# Altium project nRF-TestDevice.PrjPCB (part 2 of 2)

## Sheet FTDI.SchDoc
size A3; DocumentNumber: 5; SheetNumber: 5; SheetTotal: 9
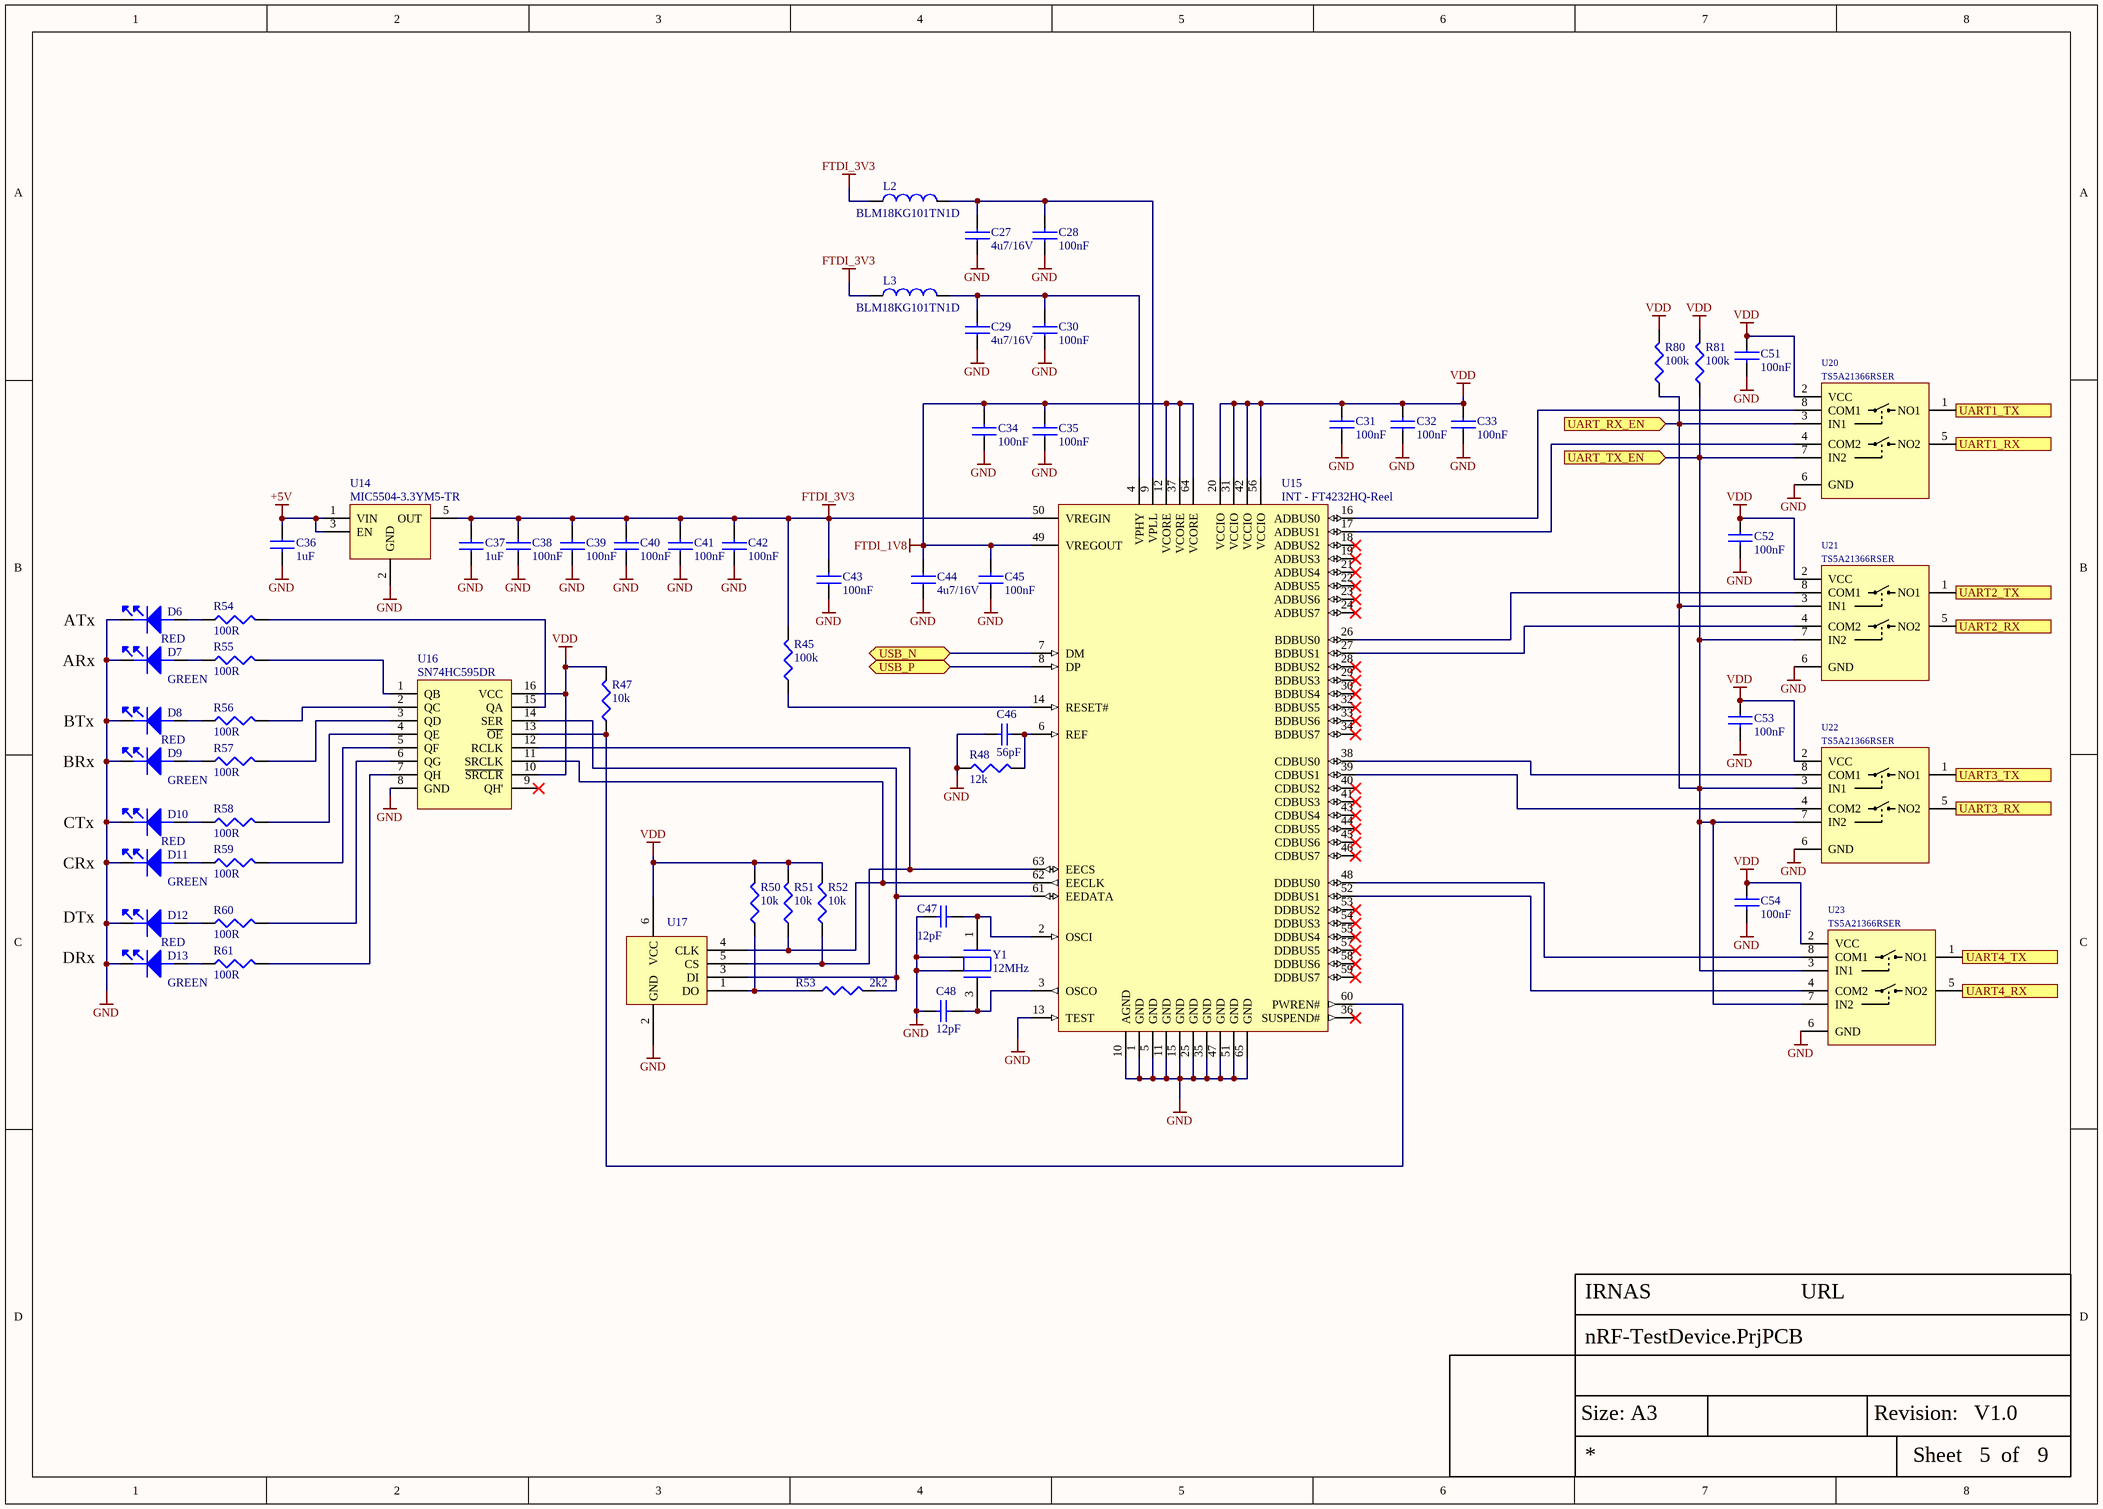
[diagram p6: FTDI.SchDoc]

### Parts
C27  4u7/16V  [CAP0603]
C28  100nF  [CAP0402]
C29  4u7/16V  [CAP0603]
C30  100nF  [CAP0402]
C31  100nF  [CAP0402]
C32  100nF  [CAP0402]
C33  100nF  [CAP0402]
C34  100nF  [CAP0402]
C35  100nF  [CAP0402]
C36  1uF  [CAP0402]
C37  1uF  [CAP0402]
C38  100nF  [CAP0402]
C39  100nF  [CAP0402]
C40  100nF  [CAP0402]
C41  100nF  [CAP0402]
C42  100nF  [CAP0402]
C43  100nF  [CAP0402]
C44  4u7/16V  [CAP0603]
C45  100nF  [CAP0402]
C46  value 56pF  [CAP0402]  (hidden comment: 56pF/50V/0402)
C47  value 12pF  [CAP0402]  (hidden comment: 12pF/50V/0402)
C48  value 12pF  [CAP0402]  (hidden comment: 12pF/50V/0402)
C51  100nF  [CAP0402]
C52  100nF  [CAP0402]
C53  100nF  [CAP0402]
C54  100nF  [CAP0402]
D6  LED RED  [LED0603]  (value not drawn)
D7  LED GREEN  [LED0603]  (value not drawn)
D8  LED RED  [LED0603]  (value not drawn)
D9  LED GREEN  [LED0603]  (value not drawn)
D10  LED RED  [LED0603]  (value not drawn)
D11  LED GREEN  [LED0603]  (value not drawn)
D12  LED RED  [LED0603]  (value not drawn)
D13  LED GREEN  [LED0603]  (value not drawn)
L2  BLM18KG101TN1D  [IND0603]
L3  BLM18KG101TN1D  [IND0603]
R45  100k  [RES0402]
R47  10k  [RES0402]
R48  12k  [RES0402]
R50  10k  [RES0402]
R51  10k  [RES0402]
R52  10k  [RES0402]
R53  2k2  [RES0402]
R54  100R  [RES0402]
R55  100R  [RES0402]
R56  100R  [RES0402]
R57  100R  [RES0402]
R58  100R  [RES0402]
R59  100R  [RES0402]
R60  100R  [RES0402]
R61  100R  [RES0402]
R80  100k  [RES0402]
R81  100k  [RES0402]
U14  MIC5504-3.3YM5-TR  [SOT23-5]
U15  INT - FT4232HQ-Reel  [QFN64_2_N]
U16  SN74HC595DR  [SOIC-16]
U17  93LC56BT-E/OT  [SOT95P270X145-6N]  (value not drawn)
U20  TS5A21366RSER  [UQFN-8]
U21  TS5A21366RSER  [UQFN-8]
U22  TS5A21366RSER  [UQFN-8]
U23  TS5A21366RSER  [UQFN-8]
Y1  12MHz  [CRY2.5X2]

### Ports
UART1_RX (in), UART1_TX (out), UART2_RX (in), UART2_TX (out), UART3_RX (in), UART3_TX (out), UART4_RX (in), UART4_TX (out), UART_RX_EN (in), UART_TX_EN (in), USB_N (bidir), USB_P (bidir)

### Nets
+5V: C36.1 U14.1(VIN) U14.3(EN)  [project net 5V]
FTDI_1V8: C34.2 C35.2 C44.2 C45.2 U15.12(VCORE) U15.37(VCORE) U15.49(VREGOUT) U15.64(VCORE)
FTDI_3V3: C37.2 C38.2 C39.2 C40.2 C41.2 C42.2 C43.2 L2.1 L3.1 R45.2 U14.5(OUT) U15.50(VREGIN)
GND: C27.1 C28.1 C29.1 C30.1 C31.1 C32.1 C33.1 C34.1 C35.1 C36.2 C37.1 C38.1 C39.1 C40.1 C41.1 C42.1 C43.1 C44.1 C45.1 C46.1 C47.1 C48.1 C51.2 C52.2 C53.2 C54.2 D6.1(cathode) D7.1(cathode) D8.1(cathode) D9.1(cathode) D10.1(cathode) D11.1(cathode) D12.1(cathode) D13.1(cathode) R48.1 U14.2(GND) U15.1(GND) U15.5(GND) U15.10(AGND) U15.11(GND) U15.13(TEST) U15.15(GND) U15.25(GND) U15.35(GND) U15.47(GND) U15.51(GND) U15.65(GND) U16.8(GND) U17.2(GND) U20.6(GND) U21.6(GND) U22.6(GND) U23.6(GND) Y1.2 Y1.4
VDD: C31.2 C32.2 C33.2 C51.1 C52.1 C53.1 C54.1 R47.2 R50.2 R51.2 R52.2 R80.2 R81.2 U15.20(VCCIO) U15.31(VCCIO) U15.42(VCCIO) U15.56(VCCIO) U16.10(~{SRCLR}) U16.16(VCC) U17.6(VCC) U20.2(VCC) U21.2(VCC) U22.2(VCC) U23.2(VCC)
P0.11: R80.1 R81.1 U20.3(IN1) U20.7(IN2) U21.3(IN1) U21.7(IN2) U22.3(IN1) U22.7(IN2) U23.3(IN1) U23.7(IN2) ; port UART_RX_EN, port UART_TX_EN
UART1_RX: U20.5(NO2) ; port UART1_RX
UART1_TX: U20.1(NO1) ; port UART1_TX
UART2_RX: U21.5(NO2) ; port UART2_RX
UART2_TX: U21.1(NO1) ; port UART2_TX
UART3_RX: U22.5(NO2) ; port UART3_RX
UART3_TX: U22.1(NO1) ; port UART3_TX
UART4_RX: U23.5(NO2) ; port UART4_RX
UART4_TX: U23.1(NO1) ; port UART4_TX
USB_N: U15.7(DM) ; port USB_N
USB_P: U15.8(DP) ; port USB_P
NetC27_2: C27.2 C28.2 L2.2 U15.9(VPLL)
NetC29_2: C29.2 C30.2 L3.2 U15.4(VPHY)
NetC46_2: C46.2 R48.2 U15.6(REF)
NetC47_2: C47.2 U15.2(OSCI) Y1.1
NetC48_2: C48.2 U15.3(OSCO) Y1.3
NetD6_2: D6.2(ANODE) R54.1
NetD7_2: D7.2(ANODE) R55.1
NetD8_2: D8.2(ANODE) R56.1
NetD9_2: D9.2(ANODE) R57.1
NetD10_2: D10.2(ANODE) R58.1
NetD11_2: D11.2(ANODE) R59.1
NetD12_2: D12.2(ANODE) R60.1
NetD13_2: D13.2(ANODE) R61.1
NetR45_1: R45.1 U15.14(RESET#)
NetR47_1: R47.1 U15.60(PWREN#) U16.13(~{OE})
NetR50_1: R50.1 R53.1 U17.1(DO)
NetR51_1: R51.1 U15.62(EECLK) U16.11(SRCLK) U17.4(CLK)
NetR52_1: R52.1 U15.63(EECS) U16.12(RCLK) U17.5(CS)
NetR53_2: R53.2 U15.61(EEDATA) U16.14(SER) U17.3(DI)
NetR54_2: R54.2 U16.15(QA)
NetR55_2: R55.2 U16.1(QB)
NetR56_2: R56.2 U16.2(QC)
NetR57_2: R57.2 U16.3(QD)
NetR58_2: R58.2 U16.4(QE)
NetR59_2: R59.2 U16.5(QF)
NetR60_2: R60.2 U16.6(QG)
NetR61_2: R61.2 U16.7(QH)
NetU15_16: U15.16(ADBUS0) U20.8(COM1)
NetU15_17: U15.17(ADBUS1) U20.4(COM2)
NetU15_26: U15.26(BDBUS0) U21.8(COM1)
NetU15_27: U15.27(BDBUS1) U21.4(COM2)
NetU15_38: U15.38(CDBUS0) U22.8(COM1)
NetU15_39: U15.39(CDBUS1) U22.4(COM2)
NetU15_48: U15.48(DDBUS0) U23.8(COM1)
NetU15_52: U15.52(DDBUS1) U23.4(COM2)

Not connected (* = marked no-connect by the designer): U15 18(ADBUS2)* 19(ADBUS3)* 21(ADBUS4)* 22(ADBUS5)* 23(ADBUS6)* 24(ADBUS7)* 28(BDBUS2)* 29(BDBUS3)* 30(BDBUS4)* 32(BDBUS5)* 33(BDBUS6)* 34(BDBUS7)* 36(SUSPEND#)* 40(CDBUS2)* 41(CDBUS3)* 43(CDBUS4)* 44(CDBUS5)* 45(CDBUS6)* 46(CDBUS7)* 53(DDBUS2)* 54(DDBUS3)* 55(DDBUS4)* 57(DDBUS5)* 58(DDBUS6)* 59(DDBUS7)*; U16 9(QH')*

### Notes on the sheet
- ATx
- ARx
- BTx
- BRx
- CTx
- CRx
- DTx
- DRx
- Size: A3
- Revision:
- Sheet
- of
- (in symbol LED - LED GREEN) GREEN
- (in symbol LED - LED RED) RED

### Library data of the parts
C27 C29 C44 = C - 4u7  16V 0603: MURATA - GRM188R61C475KAAJD - CAP, MLCC, X5R, 4.7UF, 16V, 0603; IRNAS Part No.: I-200001; Ceramic Capacitor Case: 0603 [1608 Metric]; Capacitance: 4.7; Voltage Rating: 16; Capacitance Tolerance: ± 10%; Dielectric Characteristic: X5; Product Range: GRM Series; SVHC: No SVHC (17-Dec-2015)<!--FANDB--><div class="features-and-benefits-container"><div class="features-and-benefits-desc-container"><span class="features-and-benefits-container-desc">SMD Multilayer Ceramic Capacitor, 0603 [1608 Metric], 4.7 µF, 16 V, ± 10%, X5; Supplier 1: Farnell; Manufacturer: MURATA; Manufacturer Part Number: GRM188R61C475KAAJD; RoHS: YES; Stock 1: 5038; Pricing 1: 10=0.16, 100=0.0929, 500=0.076, 1000=0.0618, 2000=0.0605, 4000=0.0425, 20000=0.0409, 40000=0.0355 (GBP); Packaging: Cut Tape; Operating Temperature Min: -55; Operating Temperature Max: 85; Automotive Qualification Standard: -; MSL: MSL 1 - Unlimited; ComponentLink1URL: http://www.farnell.com/datasheets/2079168.pdf; ComponentLink1Description: http://www.farnell.com/datasheets/2079168.pdf; Supplier Part Number 1: 2611924
C28 C30-C35 C38-C43 C45 C51-C54 = C - 100nF/0402: as C18 on sheet ADC; Supplier 1: Farnell; Manufacturer: Multicomp; Manufacturer Part Number: MC0402X104J160CT; Stock 1: 3230; Pricing 1: 10=0.0139, 100=0.0108, 500=0.0076, 2500=0.0051, 5000=0.0038 (EUR); Case Code (Metric): 1005; Case Code (Imperial): 0402; Min Operating Temperature: -55°C; Max Operating Temperature: 85°C; Capacitance: 100nF; Dielectric: X5R; Packaging: Tape and Reel; Tolerance: 5%; Voltage Rating (DC): 16V; REACH SVHC: No SVHC; ComponentLink1URL: http://www.farnell.com/datasheets/2117933.pdf; ComponentLink1Description: http://www.farnell.com/datasheets/2117933.pdf; ComponentLink2URL: http://www.farnell.com/datasheets/2117900.pdf; ComponentLink2Description: http://www.farnell.com/datasheets/2117900.pdf; Supplier Part Number 1: 2627419
C36 C37 = C - 1uF/0402: CAP CER 1UF 10V 20% X5R 0402; Manufacturer: Murata; Manufacturer Part Number: GRM155R61A105ME15D; IRNAS Part No.: /; Supplier 1: Farnell; Stock 1: 0; Pricing 1: 10=0.0379, 100=0.0266, 500=0.0156, 2500=0.0098, 5000=0.0083 (EUR); Mount: Surface Mount; Case/Package: 0402; Case Code (Metric): 1005; Case Code (Imperial): 0402; Min Operating Temperature: -55°C; Max Operating Temperature: 85°C; Capacitance: 1uF; Tolerance: 20%; Voltage Rating: 10V; Packaging: Tape and Reel; Package Quantity: 1; Dielectric: X5R; Voltage: 10V; Voltage Rating (DC): 10V; Length: 1mm; Height: 0.5mm; Width: 0.02inch; Thickness: 0.022inch; Depth: 0.5mm; Radiation Hardening: No; REACH SVHC: No SVHC; Lead Free: Lead Free; ComponentLink1URL: https://datasheet.ciiva.com/164/product-164665.pdf; ComponentLink1Description: https://datasheet.ciiva.com/164/product-164665.pdf; ComponentLink2URL: https://datasheet.ciiva.com/11616/product-11616508.pdf; ComponentLink2Description: https://datasheet.ciiva.com/11616/product-11616508.pdf; ComponentLink3URL: https://datasheet.ciiva.com/46418/1769893-46418047.pdf; ComponentLink3Description: https://datasheet.ciiva.com/46418/1769893-46418047.pdf; ComponentLink4URL: https://datasheet.ciiva.com/164/partnumbering-e-01-164666.pdf; ComponentLink4Description: https://datasheet.ciiva.com/164/partnumbering-e-01-164666.pdf; ComponentLink5URL: https://datasheet.ciiva.com/164/partnumbering-e-01-164667.pdf; ComponentLink5Description: https://datasheet.ciiva.com/164/partnumbering-e-01-164667.pdf; Supplier Part Number 1: 2426953
C46 = C - 56pF/50V/0402: CAP CER 56PF 50V C0G/NP0 0402; Published: 8-Jun-2000; LatestRevisionDate: 05-oct-2007  -  Semtech; LatestRevisionNote: Re-released for DXP Platform.; Publisher: Altium Limited; Supplier 1: Digi-Key; Supplier Part Number 1: 490-1288-1-ND
C47 C48 = C - 12pF/50V/0402: CAP CER 12PF 50V C0G/NP0 0402; Published: 8-Jun-2000; LatestRevisionDate: 05-oct-2007  -  Semtech; LatestRevisionNote: Re-released for DXP Platform.; Publisher: Altium Limited; Supplier 1: Digi-Key; Supplier Part Number 1: 490-5924-1-ND
D6 D8 D10 D12 = LED - LED RED: BROADCOM LIMITED - HSMS-C190 - LED, RED, 10MCD, 626NM; LED Mounting: SMD; Forward Current If: 20; Forward Voltage: 2.1; Wavelength Typ: 626; Luminous Intensity: 10; Viewing Angle: 170°; Lens Shape: Rectangular; SVHC: No SVHC (17-Dec-2015)<!--FANDB--><div class="features-and-benefits-container"><div class="features-and-benefits-description"><span class="features-benefits-value">The HSMS-C190 is a HER SMD Chip LED with untinted/diffused lens, made of GaP. It is designed in an industry standard package 1.6 x 0.8mm footprint with 0.8mm profile. It is compatible with IR reflow solder processes. The small size and wide viewing angle make this LED prime choices for backlighting applications and front panel illumination especially where space is a premium.</span></div><div class="features-and-benefits-list"><ul class="features-and-benefits-list-list"><li class="features-and-benefits-list-item">Small size</li><li class="features-and-benefits-list-item">Industry standard footprint</li><li class="features-and-benefits-list-item">Compatible with IR solder</li><li class="features-and-benefits-list-item">Diffused optics</li><li class="features-and-benefits-list-item">-40 to 85; Supplier 1: Farnell; Manufacturer: BROADCOM LIMITED; Manufacturer Part Number: HSMS-C190; RoHS: YES; Stock 1: 7534; Pricing 1: 1=0.361, 10=0.256, 50=0.235, 100=0.106, 200=0.101 (GBP); LED Colour: Red; Bulb Size: -; Packaging: Cut Tape; Product Range: -; Automotive Qualification Standard: -; MSL: -; ComponentLink1URL: http://www.farnell.com/datasheets/313031.pdf; ComponentLink1Description: http://www.farnell.com/datasheets/313031.pdf; ComponentLink2URL: http://www.farnell.com/datasheets/1681524.pdf; ComponentLink2Description: http://www.farnell.com/datasheets/1681524.pdf; ComponentLink3URL: http://www.farnell.com/datasheets/2165483.pdf; ComponentLink3Description: http://www.farnell.com/datasheets/2165483.pdf; Supplier Part Number 1: 2497356
D7 D9 D11 D13 = LED - LED GREEN: HSME-C191 -  LED, Green, SMD, 0603, 20 mA, 2.1 V, 572 nm; Manufacturer: BROADCOM LIMITED; Manufacturer Part Number: HSMS-C190; LED Colour: Red; Forward Current If: 20; Forward Voltage: 2.1; Wavelength Typ: 626; Luminous Intensity: 10; Viewing Angle: 170°; Lens Shape: Rectangular; SVHC: No SVHC (17-Dec-2015)<!--FANDB--><div class="features-and-benefits-container"><div class="features-and-benefits-description"><span class="features-benefits-value">The HSMS-C190 is a HER SMD Chip LED with untinted/diffused lens, made of GaP. It is designed in an industry standard package 1.6 x 0.8mm footprint with 0.8mm profile. It is compatible with IR reflow solder processes. The small size and wide viewing angle make this LED prime choices for backlighting applications and front panel illumination especially where space is a premium.</span></div><div class="features-and-benefits-list"><ul class="features-and-benefits-list-list"><li class="features-and-benefits-list-item">Small size</li><li class="features-and-benefits-list-item">Industry standard footprint</li><li class="features-and-benefits-list-item">Compatible with IR solder</li><li class="features-and-benefits-list-item">Diffused optics</li><li class="features-and-benefits-list-item">-40 to 85; RoHS: YES; Stock 1: 7534; Pricing 1: 1=0.361, 10=0.256, 50=0.235, 100=0.106, 200=0.101 (GBP); LED Mounting: SMD; Bulb Size: -; Packaging: Cut Tape; Product Range: -; Automotive Qualification Standard: -; MSL: -; ComponentLink3URL: http://www.farnell.com/datasheets/2095939.pdf?_ga=2.85835929.1644194861.1561957338-1373726713.1554121096; ComponentLink3Description: Datasheet; Supplier 1: Farnell; Supplier Part Number 1: 1219743
L2 L3 = L - BLM18KG101TN1D: Ferrite Bead, 0603 [1608 Metric], 100 ohm, 3 A, BLM18K Series, 0.03 ohm, ± 25%; ComponentLink1Description: Datasheet; ComponentLink1URL: https://www.murata.com/en-global/api/pdfdownloadapi?cate=luNoiseSupprFilteChipFerriBead&partno=BLM18KG101TN1%23; Supplier 1: Farnell; Supplier Part Number 1: 2443239
R45 R80 R81 = R - 100k/0402: MULTICOMP   MCWR04X1003FTL   RES, THICK FILM, 100KOHM, 1%, 0.0625W; IRNAS Part No.: I-100013; Resistance: 100kR; Power Rating: 62.5mW; Voltage Rating: 50V; Temperature Coefficient: 100ppm/°C; Supplier 1: Farnell; Manufacturer: Multicomp; Manufacturer Part Number: MCWR04X1003FTL; Stock 1: 161188; Pricing 1: 10=0.0029, 100=0.0017, 500=0.0012, 2500=0.001, 5000=0.0008 (EUR); Mount: Surface Mount; Case/Package: 0402; Case Code (Metric): 1005; Case Code (Imperial): 0402; Tolerance: 1%; Packaging: Cut Tape; Composition: Thick Film; Voltage Rating (DC): 50V; REACH SVHC: No SVHC; ComponentLink1URL: https://datasheet.ciiva.com/46386/1849611-46386524.pdf; ComponentLink1Description: https://datasheet.ciiva.com/46386/1849611-46386524.pdf; Supplier Part Number 1: 2447094
R47 R50-R52 = R - 10k/0402: MULTICOMP         MCWR04X1002FTL             SMD Chip Resistor, Thick Film, 10 kohm, 50 V, 0402 [1005 Metric], 62.5 mW,  1%, MCWR Series; IRNAS Part No.: I-100014; Resistance: 10kR; Voltage Rating: 50V; Power Rating: 62.5mW; Temperature Coefficient: 100ppm/°C; Supplier 1: Farnell; Manufacturer: Multicomp; Manufacturer Part Number: MCWR04X1002FTL; Stock 1: 602609; Pricing 1: 10=0.0029, 100=0.0017, 500=0.0012, 2500=0.001, 5000=0.0008 (EUR); Case/Package: 0402; Case Code (Metric): 1005; Case Code (Imperial): 0402; Packaging: Cut Tape; Composition: Thick Film; Tolerance: 1%; Voltage Rating (DC): 50V; REACH SVHC: No SVHC; ComponentLink1URL: http://www.farnell.com/datasheets/1849611.pdf; ComponentLink1Description: http://www.farnell.com/datasheets/1849611.pdf; Supplier Part Number 1: 2447096
R48 = R - 12k/0402: MULTICOMP         MCWR04X1202FTL             SMD Chip Resistor, Thick Film, 12 kohm, 50 V, 0402 [1005 Metric], 62.5 mW,  1%, MCWR Series; IRNAS Part No.: /; Voltage Rating (DC): 50V; Resistance: 12kR; Power Rating: 62.5mW; Temperature Coefficient: 100ppm/°C; Supplier 1: Farnell; Manufacturer: Multicomp; Manufacturer Part Number: MCWR04X1202FTL; Stock 1: 11542; Pricing 1: 10=0.0033, 100=0.002, 500=0.0014, 2500=0.0011, 5000=0.0009 (EUR); Case/Package: 0402; Case Code (Metric): 1005; Case Code (Imperial): 0402; Packaging: Cut Tape; Tolerance: 1%; Voltage Rating: 50V; Composition: Thick Film; REACH SVHC: No SVHC; ComponentLink1URL: http://www.farnell.com/datasheets/1849611.pdf; ComponentLink1Description: http://www.farnell.com/datasheets/1849611.pdf; Supplier Part Number 1: 2447104
R53 = R - 2k2/0402: SMD Chip Resistor, 2.2 kohm, ± 1%, 62.5 mW, 0402 [1005 Metric], Thick Film, General Purpose /; ComponentLink1Description: Datasheet; ComponentLink1URL: http://www.farnell.com/datasheets/2860681.pdf?_ga=2.145444532.1645569087.1597147308-393619177.1578660480; Supplier 1: Farnell; Supplier Part Number 1: 2447148
R54-R61 = R - 100R/0402: MULTICOMP         MCMR04X1000FTL            SMD Chip Resistor, Ceramic, MCMR Series, 100 ohm, 50 V, 0402 [1005 Metric], 62.5 mW,  1%; IRNAS Part No.: /; Temperature Coefficient: 100ppm/°C; Power Rating: 62.5mW; Voltage Rating: 50V; Supplier 1: Farnell; Manufacturer: Multicomp; Manufacturer Part Number: MCMR04X1000FTL; Stock 1: 62365; Pricing 1: 10=0.0071, 100=0.0042, 500=0.003, 2500=0.0024, 5000=0.0019 (GBP); Case/Package: 0402; Case Code (Metric): 1005; Case Code (Imperial): 0402; Resistance: 100R; Tolerance: 1%; Composition: Ceramic; Packaging: Cut Tape; Voltage Rating (DC): 50V; REACH SVHC: No SVHC; ComponentLink1URL: https://datasheet.ciiva.com/28692/1716705-28692087.pdf; ComponentLink1Description: https://datasheet.ciiva.com/28692/1716705-28692087.pdf; ComponentLink2URL: https://datasheet.ciiva.com/22708/1716705-22708156.pdf; ComponentLink2Description: https://datasheet.ciiva.com/22708/1716705-22708156.pdf; Supplier Part Number 1: 2072515
U14 = V_LIN - MIC5504-3.3YM5-TR: Fixed LDO Voltage Regulator, 2.5V to 5.5V, 160mV Dropout, 3.3Vout, 300mAout, SOT-23-5; Manufacturer: ON SEMICONDUCTOR; Manufacturer Part Number: LM2596DSADJG; Topology: Buck (Step Down); Input Voltage Min: 4.5; Input Voltage Max: 45; No. of Outputs: 1; DC / DC Converter IC Case: TO-263; No. of Pins: 5; Output Current: 3; Output Voltage Min: 1.23; Output Voltage Max: 37; Switching Frequency: 150; SVHC: No SVHC (12-Jan-2017; RoHS: YES; Operating Temperature Max: 125; Packaging: Each; Product Range: -; Automotive Qualification Standard: -; MSL: MSL 1 - Unlimited; ComponentLink1Description: Datasheet; ComponentLink1URL: http://www.farnell.com/datasheets/2108564.pdf?_ga=2.247133379.691918385.1573213895-1730437145.1573213895; Supplier 1: Farnell; Supplier Part Number 1: 2510377
U15 = INT - FT4232HQ-Reel: Quad High Speed USB To Multipurpose UART/MPSSE IC, 64-pin QFN, Tape and Reel; Manufacturer: FTDI; DatasheetVersion: ver 2.2, Jan-2012; PackageVersion: Jan-12; PackageReference: QFN64_2; PackageDescription: 64-Pin Quad Flat No-Lead, 9 x 9 mm Body, 0.5 mm Pitch, 4.35 x 4.35 mm Exposed Pad; PartNumber: FT4232HQ-Reel; ComponentLink1Description: Manufacturer URL; ComponentLink1URL: http://www.ftdichip.com/; ComponentLink2Description: Datasheet; ComponentLink2URL: http://www.ftdichip.com/Support/Documents/DataSheets/ICs/DS_FT4232H.pdf
U16 = INT - SN74HC595DR: Shift Register, 74HC595, Serial to Parallel, 1 Element, 8 bit, SOIC, 16 Pins; Supplier 1: Farnell; Supplier Part Number 1: 3006739
U17 = MEM - 93LC56BT-E/OT: 2K,  128 X 16,  SERIAL EE,   EXT6 SOT-23  T/R; Manufacturer: Microchip; Max Supply Voltage: 5.5V; Min Supply Voltage: 2.5V; Access Time: 250ns; Frequency: 2MHz; Nominal Supply Current: 2mA; Density: 2Kb; Memory Type: EEPROM; Supplier 1: Digi-Key; Manufacturer Part Number: 93LC56BT-E/OT; Stock 1: 1557; Pricing 1: 1 = 0.29000, 25 = 0.28360, 100 = 0.27300 (USD); RoHS: Yes; Mount: Surface Mount; Case/Package: SOT-23-6; Number of Pins: 6; Min Operating Temperature: -40°C; Max Operating Temperature: 125°C; Package Quantity: 3000; Packaging: Tape and Reel; Interface: Serial; Memory Size: 2Kb; Max Frequency: 2MHz; Radiation Hardening: No; Lead Free: Lead Free; ComponentLink1URL: https://datasheet.ciiva.com/16622/jp013939-16622122.pdf?src-supplier=Avnet+Europe; ComponentLink1Description: https://datasheet.ciiva.com/16622/jp013939-16622122.pdf?src-supplier=Avnet+Europe; ComponentLink2URL: https://datasheet.ciiva.com/9281/jp013939-9281661.pdf?src-supplier=Avnet; ComponentLink2Description: https://datasheet.ciiva.com/9281/jp013939-9281661.pdf?src-supplier=Avnet; Supplier Part Number 1: 93LC56BT-E/OTCT-ND
U20-U23 = SW - TS5A21366RSER: IC SWITCH DUAL SPST 8QFN; Opis / Description: TS5A21366RSER; Value: TS5A21366RSER; Supplier 1: Digi-Key; Supplier Part Number 1: 296-25285-1-ND
Y1 = X - 16MHz: 12MHz ±20ppm Crystal 10pF 150 Ohm -40°C ~ 85°C  Surface Mount 4-SMD, No Lead (DFN, LCC); Manufacturer: Abracon; Manufacturer Part Number: ABM10-166-12.000MHZ-T3; IRNAS Part No.: /; ESR (Equivalent Series Resistance): 150R; Frequency Stability: 30ppm; Supplier 1: Farnell; Stock 1: 8209; Pricing 1: 5=1.18, 50=0.742, 250=0.675, 500=0.607, 1500=0.569, 3000=0.558, 15000=0.547 (EUR); Mount: Surface Mount; Case/Package: CSMD; Number of Pins: 4; Min Operating Temperature: -40°C; Max Operating Temperature: 85°C; Package Quantity: 3000; Packaging: Tape and Reel; Frequency: 12MHz; Load Capacitance: 10pF; Tolerance: 20ppm; Frequency Tolerance: 20ppm; Termination: SMD/SMT; Series Resistance: 150R; Length: 2.5mm; Height: 0.028inch; Width: 2mm; Depth: 2mm; Lead Free: Lead Free; REACH SVHC: No SVHC; ComponentLink1URL: https://datasheet.ciiva.com/16410/abm10-16410918.pdf; ComponentLink1Description: https://datasheet.ciiva.com/16410/abm10-16410918.pdf; ComponentLink2URL: https://datasheet.ciiva.com/856/abm10-856088.pdf; ComponentLink2Description: https://datasheet.ciiva.com/856/abm10-856088.pdf; ComponentLink3URL: https://datasheet.ciiva.com/856/abm10-856089.pdf; ComponentLink3Description: https://datasheet.ciiva.com/856/abm10-856089.pdf; ComponentLink4URL: https://datasheet.ciiva.com/856/abm10-856090.pdf; ComponentLink4Description: https://datasheet.ciiva.com/856/abm10-856090.pdf; Supplier Part Number 1: 2849406

## Sheet IDC.SchDoc
size A3; DocumentNumber: 9; SheetNumber: 9; SheetTotal: 9
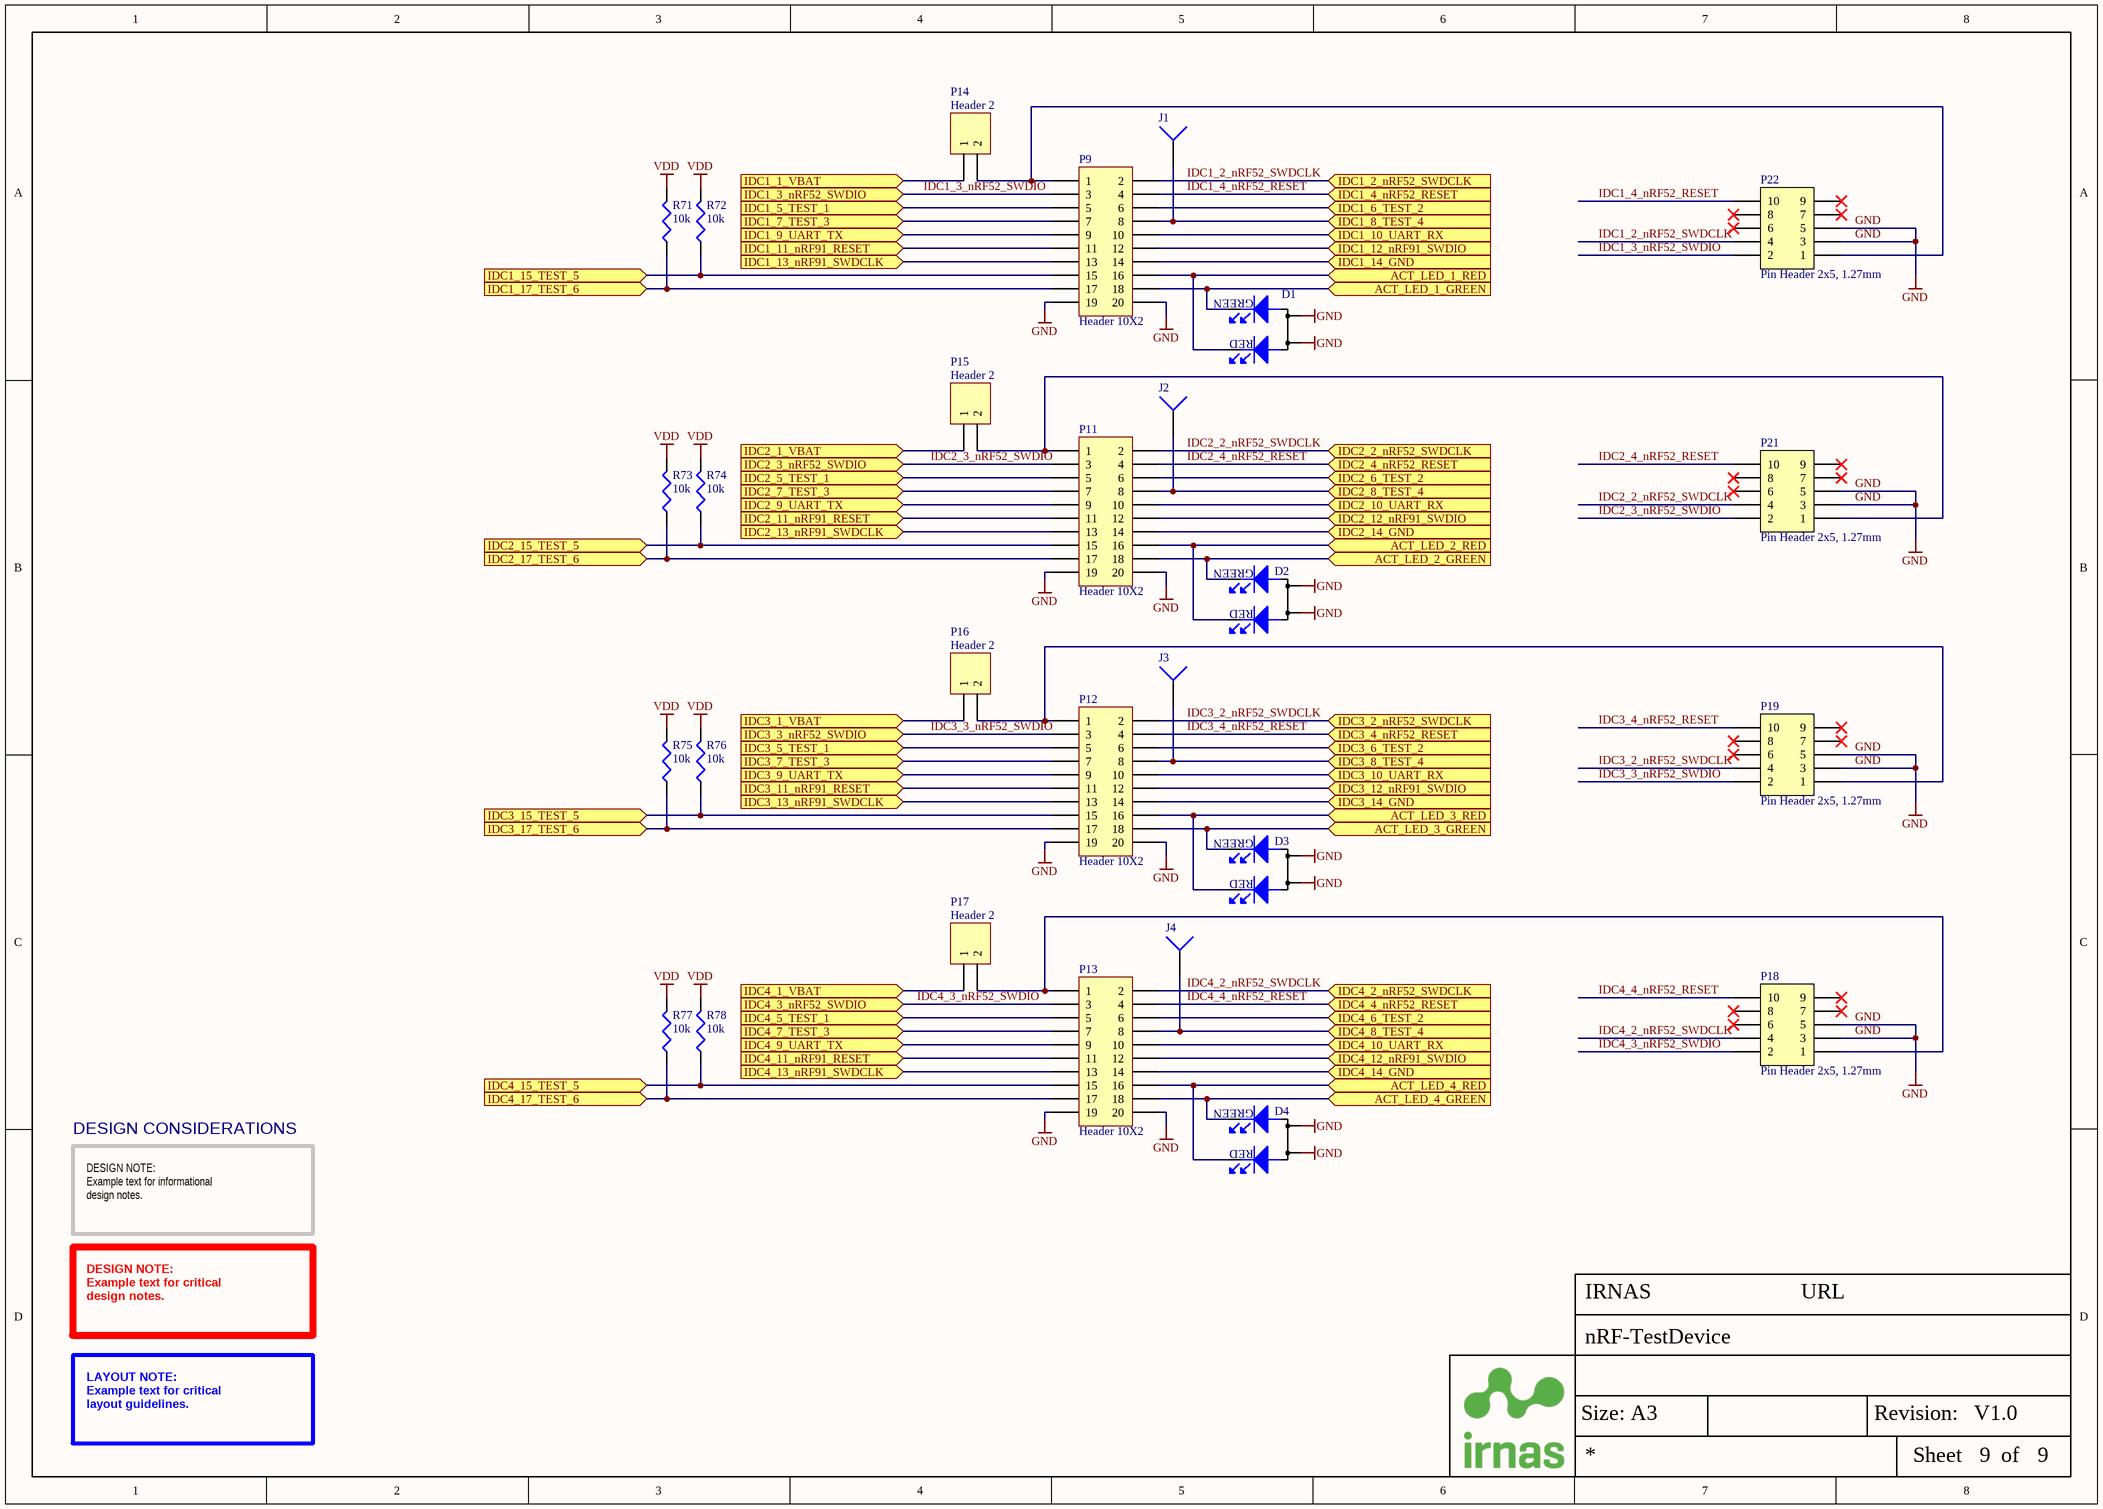
[diagram p7: IDC.SchDoc]

### Parts
D1  KPB-3025ESGC-F01  [LED - 2mm x 2.5mm]  (value not drawn)
D2  KPB-3025ESGC-F01  [LED - 2mm x 2.5mm]  (value not drawn)
D3  KPB-3025ESGC-F01  [LED - 2mm x 2.5mm]  (value not drawn)
D4  KPB-3025ESGC-F01  [LED - 2mm x 2.5mm]  (value not drawn)
J1  Socket  [PIN1]  (value not drawn)
J2  Socket  [PIN1]  (value not drawn)
J3  Socket  [PIN1]  (value not drawn)
J4  Socket  [PIN1]  (value not drawn)
P9  Header 10X2  [HDR2X10]
P11  Header 10X2  [HDR2X10]
P12  Header 10X2  [HDR2X10]
P13  Header 10X2  [HDR2X10]
P14  Header 2  [HDR1X2]
P15  Header 2  [HDR1X2]
P16  Header 2  [HDR1X2]
P17  Header 2  [HDR1X2]
P18  Pin Header 2x5, 1.27mm  [HDR_2x5-SMD-1.27mm-K]
P19  Pin Header 2x5, 1.27mm  [HDR_2x5-SMD-1.27mm-K]
P21  Pin Header 2x5, 1.27mm  [HDR_2x5-SMD-1.27mm-K]
P22  Pin Header 2x5, 1.27mm  [HDR_2x5-SMD-1.27mm-K]
R71  10k  [RES0402]
R72  10k  [RES0402]
R73  10k  [RES0402]
R74  10k  [RES0402]
R75  10k  [RES0402]
R76  10k  [RES0402]
R77  10k  [RES0402]
R78  10k  [RES0402]

### Ports
ACT_LED_1_GREEN (in), ACT_LED_1_RED (in), ACT_LED_2_GREEN (in), ACT_LED_2_RED (in), ACT_LED_3_GREEN (in), ACT_LED_3_RED (in), ACT_LED_4_GREEN (in), ACT_LED_4_RED (in), IDC1_1_VBAT (in), IDC1_2_nRF52_SWDCLK (in), IDC1_3_nRF52_SWDIO (in), IDC1_4_nRF52_RESET (in), IDC1_5_TEST_1 (in), IDC1_6_TEST_2 (in), IDC1_7_TEST_3 (in), IDC1_8_TEST_4 (in), IDC1_9_UART_TX (in), IDC1_10_UART_RX (in), IDC1_11_nRF91_RESET (in), IDC1_12_nRF91_SWDIO (in), IDC1_13_nRF91_SWDCLK (in), IDC1_14_GND (in), IDC1_15_TEST_5 (in), IDC1_17_TEST_6 (in), IDC2_1_VBAT (in), IDC2_2_nRF52_SWDCLK (in), IDC2_3_nRF52_SWDIO (in), IDC2_4_nRF52_RESET (in), IDC2_5_TEST_1 (in), IDC2_6_TEST_2 (in), IDC2_7_TEST_3 (in), IDC2_8_TEST_4 (in), IDC2_9_UART_TX (in), IDC2_10_UART_RX (in), IDC2_11_nRF91_RESET (in), IDC2_12_nRF91_SWDIO (in), IDC2_13_nRF91_SWDCLK (in), IDC2_14_GND (in), IDC2_15_TEST_5 (in), IDC2_17_TEST_6 (in), IDC3_1_VBAT (in), IDC3_2_nRF52_SWDCLK (in), IDC3_3_nRF52_SWDIO (in), IDC3_4_nRF52_RESET (in), IDC3_5_TEST_1 (in), IDC3_6_TEST_2 (in), IDC3_7_TEST_3 (in), IDC3_8_TEST_4 (in), IDC3_9_UART_TX (in), IDC3_10_UART_RX (in), IDC3_11_nRF91_RESET (in), IDC3_12_nRF91_SWDIO (in), IDC3_13_nRF91_SWDCLK (in), IDC3_14_GND (in), IDC3_15_TEST_5 (in), IDC3_17_TEST_6 (in), IDC4_1_VBAT (in), IDC4_2_nRF52_SWDCLK (in), IDC4_3_nRF52_SWDIO (in), IDC4_4_nRF52_RESET (in), IDC4_5_TEST_1 (in), IDC4_6_TEST_2 (in), IDC4_7_TEST_3 (in), IDC4_8_TEST_4 (in), IDC4_9_UART_TX (in), IDC4_10_UART_RX (in), IDC4_11_nRF91_RESET (in), IDC4_12_nRF91_SWDIO (in), IDC4_13_nRF91_SWDCLK (in), IDC4_14_GND (in), IDC4_15_TEST_5 (in), IDC4_17_TEST_6 (in)

### Nets
GND: D1.1(ANODE) D1.3(ANODE) D2.1(ANODE) D2.3(ANODE) D3.1(ANODE) D3.3(ANODE) D4.1(ANODE) D4.3(ANODE) P9.14 P9.19 P9.20 P11.14 P11.19 P11.20 P12.14 P12.19 P12.20 P13.14 P13.19 P13.20 P18.3 P18.5 P19.3 P19.5 P21.3 P21.5 P22.3 P22.5 ; port IDC4_14_GND, port IDC3_14_GND, port IDC1_14_GND, port IDC2_14_GND
VBAT_1: P14.1 ; port IDC1_1_VBAT
VBAT_2: P15.1 ; port IDC2_1_VBAT
VBAT_3: P16.1 ; port IDC3_1_VBAT
VBAT_4: P17.1 ; port IDC4_1_VBAT
VDD: R71.2 R72.2 R73.2 R74.2 R75.2 R76.2 R77.2 R78.2
ACT_LED_1_GREEN: D1.4(cathode) P9.18 ; port ACT_LED_1_GREEN
ACT_LED_1_RED: D1.2(cathode) P9.16 ; port ACT_LED_1_RED
ACT_LED_2_GREEN: D2.4(cathode) P11.18 ; port ACT_LED_2_GREEN
ACT_LED_2_RED: D2.2(cathode) P11.16 ; port ACT_LED_2_RED
ACT_LED_3_GREEN: D3.4(cathode) P12.18 ; port ACT_LED_3_GREEN
ACT_LED_3_RED: D3.2(cathode) P12.16 ; port ACT_LED_3_RED
ACT_LED_4_GREEN: D4.4(cathode) P13.18 ; port ACT_LED_4_GREEN
ACT_LED_4_RED: D4.2(cathode) P13.16 ; port ACT_LED_4_RED
DIO16: P13.17 R77.1 ; port IDC4_17_TEST_6
DIO17: P13.15 R78.1 ; port IDC4_15_TEST_5
DIO18: P12.17 R75.1 ; port IDC3_17_TEST_6
DIO19: P12.15 R76.1 ; port IDC3_15_TEST_5
DIO20: P11.17 R73.1 ; port IDC2_17_TEST_6
DIO21: P11.15 R74.1 ; port IDC2_15_TEST_5
DIO22: P9.17 R71.1 ; port IDC1_17_TEST_6
DIO23: P9.15 R72.1 ; port IDC1_15_TEST_5
IDC1_2_nRF52_SWDCLK: P9.2 P22.4 ; port IDC1_2_nRF52_SWDCLK
IDC1_3_nRF52_SWDIO: P9.3 P22.2 ; port IDC1_3_nRF52_SWDIO
IDC1_4_nRF52_RESET: P9.4 P22.10 ; port IDC1_4_nRF52_RESET
IDC1_5_TEST_1: P9.5 ; port IDC1_5_TEST_1
IDC1_6_TEST_2: P9.6 ; port IDC1_6_TEST_2
IDC1_7_TEST_3: P9.7 ; port IDC1_7_TEST_3
IDC1_8_TEST_4: J1.1 P9.8 ; port IDC1_8_TEST_4
IDC1_9_UART_TX: P9.9 ; port IDC1_9_UART_TX
IDC1_10_UART_RX: P9.10 ; port IDC1_10_UART_RX
IDC1_11_nRF91_RESET: P9.11 ; port IDC1_11_nRF91_RESET
IDC1_12_nRF91_SWDIO: P9.12 ; port IDC1_12_nRF91_SWDIO
IDC1_13_nRF91_SWDCLK: P9.13 ; port IDC1_13_nRF91_SWDCLK
IDC2_2_nRF52_SWDCLK: P11.2 P21.4 ; port IDC2_2_nRF52_SWDCLK
IDC2_3_nRF52_SWDIO: P11.3 P21.2 ; port IDC2_3_nRF52_SWDIO
IDC2_4_nRF52_RESET: P11.4 P21.10 ; port IDC2_4_nRF52_RESET
IDC2_5_TEST_1: P11.5 ; port IDC2_5_TEST_1
IDC2_6_TEST_2: P11.6 ; port IDC2_6_TEST_2
IDC2_7_TEST_3: P11.7 ; port IDC2_7_TEST_3
IDC2_8_TEST_4: J2.1 P11.8 ; port IDC2_8_TEST_4
IDC2_9_UART_TX: P11.9 ; port IDC2_9_UART_TX
IDC2_10_UART_RX: P11.10 ; port IDC2_10_UART_RX
IDC2_11_nRF91_RESET: P11.11 ; port IDC2_11_nRF91_RESET
IDC2_12_nRF91_SWDIO: P11.12 ; port IDC2_12_nRF91_SWDIO
IDC2_13_nRF91_SWDCLK: P11.13 ; port IDC2_13_nRF91_SWDCLK
IDC3_2_nRF52_SWDCLK: P12.2 P19.4 ; port IDC3_2_nRF52_SWDCLK
IDC3_3_nRF52_SWDIO: P12.3 P19.2 ; port IDC3_3_nRF52_SWDIO
IDC3_4_nRF52_RESET: P12.4 P19.10 ; port IDC3_4_nRF52_RESET
IDC3_5_TEST_1: P12.5 ; port IDC3_5_TEST_1
IDC3_6_TEST_2: P12.6 ; port IDC3_6_TEST_2
IDC3_7_TEST_3: P12.7 ; port IDC3_7_TEST_3
IDC3_8_TEST_4: J3.1 P12.8 ; port IDC3_8_TEST_4
IDC3_9_UART_TX: P12.9 ; port IDC3_9_UART_TX
IDC3_10_UART_RX: P12.10 ; port IDC3_10_UART_RX
IDC3_11_nRF91_RESET: P12.11 ; port IDC3_11_nRF91_RESET
IDC3_12_nRF91_SWDIO: P12.12 ; port IDC3_12_nRF91_SWDIO
IDC3_13_nRF91_SWDCLK: P12.13 ; port IDC3_13_nRF91_SWDCLK
IDC4_2_nRF52_SWDCLK: P13.2 P18.4 ; port IDC4_2_nRF52_SWDCLK
IDC4_3_nRF52_SWDIO: P13.3 P18.2 ; port IDC4_3_nRF52_SWDIO
IDC4_4_nRF52_RESET: P13.4 P18.10 ; port IDC4_4_nRF52_RESET
IDC4_5_TEST_1: P13.5 ; port IDC4_5_TEST_1
IDC4_6_TEST_2: P13.6 ; port IDC4_6_TEST_2
IDC4_7_TEST_3: P13.7 ; port IDC4_7_TEST_3
IDC4_8_TEST_4: J4.1 P13.8 ; port IDC4_8_TEST_4
IDC4_9_UART_TX: P13.9 ; port IDC4_9_UART_TX
IDC4_10_UART_RX: P13.10 ; port IDC4_10_UART_RX
IDC4_11_nRF91_RESET: P13.11 ; port IDC4_11_nRF91_RESET
IDC4_12_nRF91_SWDIO: P13.12 ; port IDC4_12_nRF91_SWDIO
IDC4_13_nRF91_SWDCLK: P13.13 ; port IDC4_13_nRF91_SWDCLK
NetP9_1: P9.1 P14.2 P22.1
NetP11_1: P11.1 P15.2 P21.1
NetP12_1: P12.1 P16.2 P19.1
NetP13_1: P13.1 P17.2 P18.1

Not connected (* = marked no-connect by the designer): P18 6* 7* 8* 9*; P19 6* 7* 8* 9*; P21 6* 7* 8* 9*; P22 6* 7* 8* 9*

### Notes on the sheet
- DESIGN CONSIDERATIONS
- DESIGN NOTE:
  Example text for informational
  design notes.
- DESIGN NOTE:
  Example text for critical
  design notes.
- LAYOUT NOTE:
  Example text for critical
  layout guidelines.
- Size: A3
- Revision:
- Sheet
- of
- (in symbol LED - KPB-3025ESGC-F01) GREEN; RED

### Library data of the parts
D1-D4 = LED - KPB-3025ESGC-F01: LED, Red, Green, SMD, 120 °, Dome, R 20mA, G 20mA; Manufacturer: KINGBRIGHT; Forward Current If: 20; Forward Voltage: 2.1; Wavelength Typ: 626; Luminous Intensity: 10; Viewing Angle: 170°; Lens Shape: Rectangular; SVHC: No SVHC (17-Dec-2015)<!--FANDB--><div class="features-and-benefits-container"><div class="features-and-benefits-description"><span class="features-benefits-value">The HSMS-C190 is a HER SMD Chip LED with untinted/diffused lens, made of GaP. It is designed in an industry standard package 1.6 x 0.8mm footprint with 0.8mm profile. It is compatible with IR reflow solder processes. The small size and wide viewing angle make this LED prime choices for backlighting applications and front panel illumination especially where space is a premium.</span></div><div class="features-and-benefits-list"><ul class="features-and-benefits-list-list"><li class="features-and-benefits-list-item">Small size</li><li class="features-and-benefits-list-item">Industry standard footprint</li><li class="features-and-benefits-list-item">Compatible with IR solder</li><li class="features-and-benefits-list-item">Diffused optics</li><li class="features-and-benefits-list-item">-40 to 85; Manufacturer Part Number: KPB-3025ESGC-F01; RoHS: YES; Stock 1: 7534; Pricing 1: 1=0.361, 10=0.256, 50=0.235, 100=0.106, 200=0.101 (GBP); LED Colour: Red; LED Mounting: SMD; Bulb Size: -; Packaging: Cut Tape; Product Range: -; Automotive Qualification Standard: -; MSL: -; Supplier 1: Farnell; Supplier Part Number 1: 8530173
P9 P11-P13 = Header 10X2: Header, 10-Pin, Dual row; LatestRevisionDate: 17-Jul-2002; LatestRevisionNote: Re-released for DXP Platform.; Publisher: Altium Limited
P14-P17 = Header 2: Header, 2-Pin; LatestRevisionDate: 17-Jul-2002; LatestRevisionNote: Re-released for DXP Platform.; Publisher: Altium Limited
P18 P19 P21 P22 = CONN-2x5: Pin Header 2x5, 1.27mm (50mil), SMD, Keying Shroud; Part Number: Pin Header 2x5 SMD, 1.27mm, KS; Manufacturer: W-CON; Manufacturer Part Number: 3132-10MS0BK00R1; Part number IPS: 00000009968; Artikkelnr Noca: 55010009; Footprint Doc: HDR_2x5-SMD-1.27mm; LatestRevisionDate: 2016-04-21; Pin Count: 10; Publisher: Nordic Semiconductor; Published: 2016-01-22; Value: Pin Header 2x5, 1.27mm; Note: *; ComponentLink1URL: *; ComponentLink1Description: Datasheet; ComponentLink2URL: *; ComponentLink2Description: Supplier link; HelpURL: \\hizz\pro\app9717\Datasheet\connectores\W-CON\3132-XXMXXBK00XX.pdf; Supplier 1: Cabcon; Supplier Part Number 1: 3132-10MS0BK00R1; Supplier 2: Samtec; Supplier Part Number 2: FTSH-105-01-F-DV-K
R71-R78 = R - 10k/0402: as R47 on sheet FTDI; Supplier 1: Farnell; Manufacturer: Multicomp; Manufacturer Part Number: MCWR04X1002FTL; Stock 1: 602609; Pricing 1: 10=0.0029, 100=0.0017, 500=0.0012, 2500=0.001, 5000=0.0008 (EUR); Case/Package: 0402; Case Code (Metric): 1005; Case Code (Imperial): 0402; Packaging: Cut Tape; Composition: Thick Film; Tolerance: 1%; Voltage Rating (DC): 50V; REACH SVHC: No SVHC; ComponentLink1URL: http://www.farnell.com/datasheets/1849611.pdf; ComponentLink1Description: http://www.farnell.com/datasheets/1849611.pdf; Supplier Part Number 1: 2447096
J1-J4 = Socket: LatestRevisionDate: 17-Jul-2002; LatestRevisionNote: Re-released for DXP Platform.; Publisher: Altium Limited

## Sheet USB.SchDoc
size A3; DocumentNumber: 4; SheetNumber: 4; SheetTotal: 9
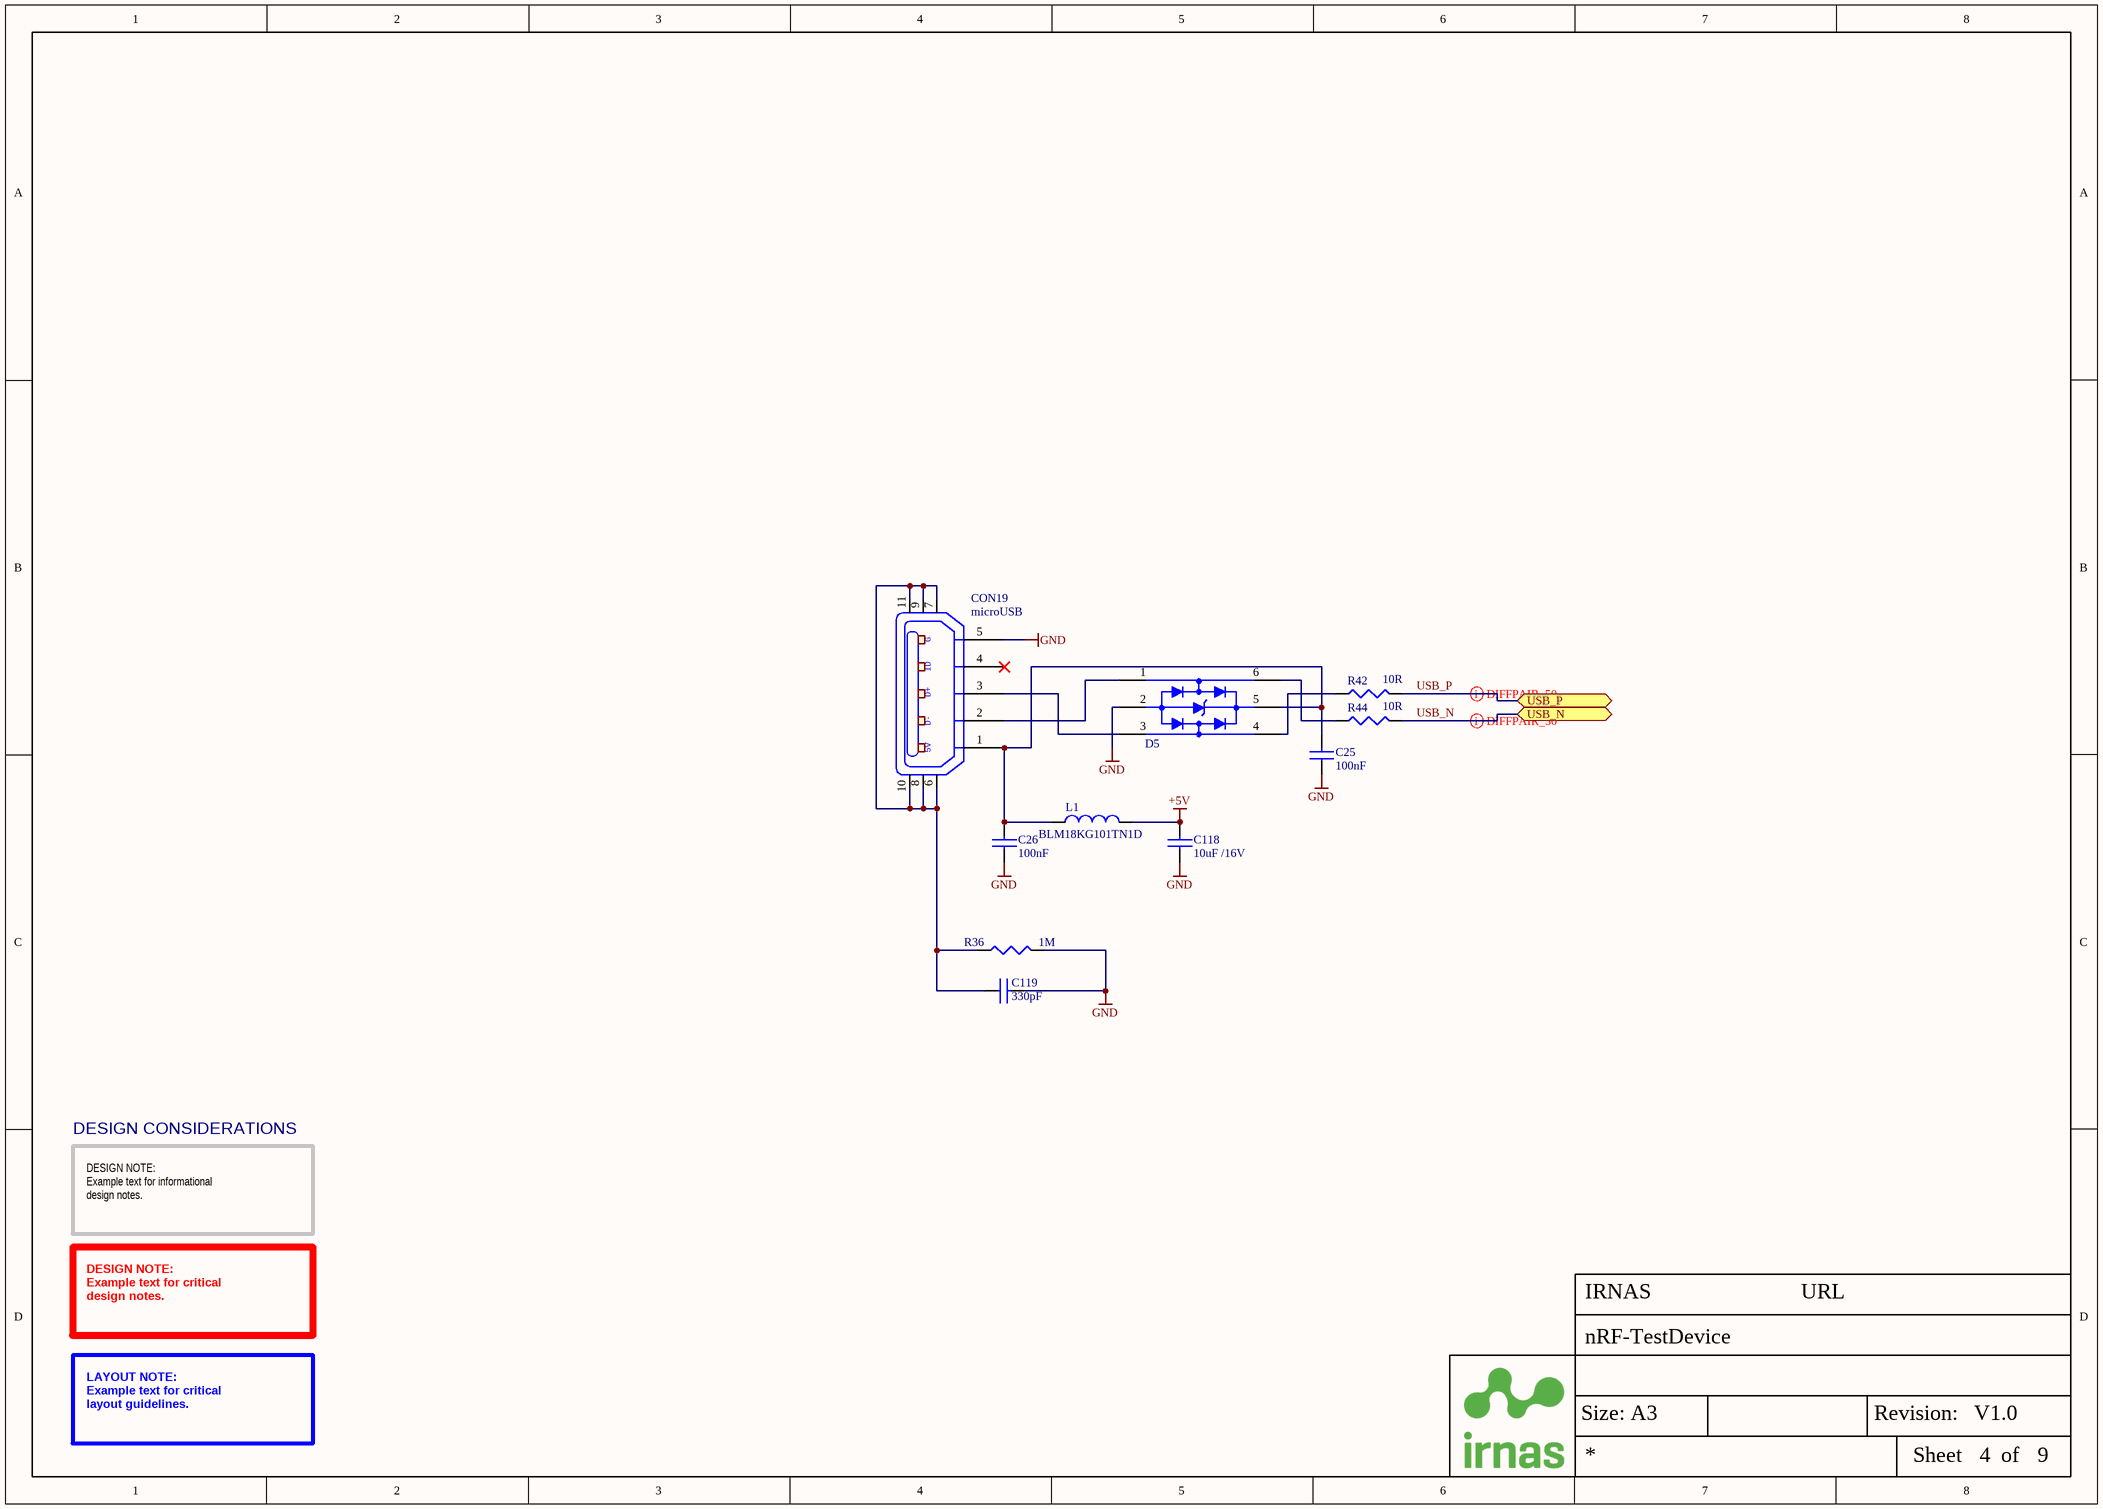
[diagram p8: USB.SchDoc]

### Parts
C25  100nF  [CAP0402]
C26  100nF  [CAP0402]
C118  10uF /16V  [CAP0805]
C119  330pF  [CAP0603]
CON19  microUSB  [microUSB-CHINA]
D5  USBLC6-2SC6  [SOT23-6]  (value not drawn)
L1  BLM18KG101TN1D  [IND0603]
R36  1M  [RES0603]
R42  10R  [RES0402]
R44  10R  [RES0402]

### Ports
USB_N (bidir), USB_P (bidir)

### Nets
+5V: C118.2 L1.2  [project net 5V]
GND: C25.1 C26.1 C118.1 C119.2 CON19.5(P5) D5.2 R36.2
USB_N: R44.2 ; port USB_N
USB_P: R42.2 ; port USB_P
NetC25_2: C25.2 C26.2 CON19.1(P1) D5.5 L1.1
NetC119_1: C119.1 CON19.6 CON19.7 CON19.8 CON19.9 CON19.10 CON19.11 R36.1
NetCON19_2: CON19.2(P2) D5.1
NetCON19_3: CON19.3(P3) D5.3
NetD5_4: D5.4 R42.1
NetD5_6: D5.6 R44.1

Not connected (* = marked no-connect by the designer): CON19 4(P4)*

### Layout directives
differential pair: USB_N, USB_P

### Notes on the sheet
- DESIGN CONSIDERATIONS
- DESIGN NOTE:
  Example text for informational
  design notes.
- DESIGN NOTE:
  Example text for critical
  design notes.
- LAYOUT NOTE:
  Example text for critical
  layout guidelines.
- Size: A3
- Revision:
- Sheet
- of
- (in symbol Micro USB CHINA 1) G; ID; D+; D-; 5V

### Library data of the parts
C25 C26 = C - 100nF/0402: MULTICOMP         MC0402X104J160CT             SMD Multilayer Ceramic Capacitor, 0402 [1005 Metric], 0.1 F, 16 V,  5%, X5R, MC Series                          New; IRNAS Part No.: /; Voltage Rating: 16V; Supplier 1: Farnell; Manufacturer: Multicomp; Manufacturer Part Number: MC0402X104J160CT; Stock 1: 3230; Pricing 1: 10=0.0139, 100=0.0108, 500=0.0076, 2500=0.0051, 5000=0.0038 (EUR); Case Code (Metric): 1005; Case Code (Imperial): 0402; Min Operating Temperature: -55°C; Max Operating Temperature: 85°C; Capacitance: 100nF; Dielectric: X5R; Packaging: Tape and Reel; Tolerance: 5%; Voltage Rating (DC): 16V; REACH SVHC: No SVHC; ComponentLink1URL: http://www.farnell.com/datasheets/2117933.pdf; ComponentLink1Description: http://www.farnell.com/datasheets/2117933.pdf; ComponentLink2URL: http://www.farnell.com/datasheets/2117900.pdf; ComponentLink2Description: http://www.farnell.com/datasheets/2117900.pdf; Supplier Part Number 1: 2627419
C118 = C - 10uF /16V: TDK - CGA4J1X5R1C106K125AC - CAP, MLCC, X5R, 10UF, 16V, 0805; IRNAS Part No.: I-200007; Supplier 1: Farnell; Manufacturer: TDK; Manufacturer Part Number: CGA4J1X5R1C106K125AC; RoHS: YES; Stock 1: 8974; Pricing 1: 5=0.41, 50=0.146, 250=0.131, 500=0.12, 1000=0.103 (GBP); ComponentLink1URL: http://bcove.me/e1v54mtm; ComponentLink1Description: http://bcove.me/e1v54mtm; ComponentLink2URL: http://www.farnell.com/datasheets/1936565.pdf; ComponentLink2Description: http://www.farnell.com/datasheets/1936565.pdf; ComponentLink3URL: http://www.farnell.com/datasheets/1683658.pdf; ComponentLink3Description: http://www.farnell.com/datasheets/1683658.pdf; Supplier Part Number 1: 2210948RL; Capacitance: 10uF; Case/Package: 0805; Case Code (Imperial): 0805
C119 = C - 330pF: Cap Ceramic 330pF 50V C0G 5% SMD 0603 125C Paper T/R; Manufacturer: Walsin Technologies; Manufacturer Part Number: 0603N331J500CT; IRNAS Part No.: /; Supplier 1: Farnell; Stock 1: 9688; Pricing 1: 10=0.066, 100=0.0446, 500=0.0195, 1000=0.0138 (GBP); Case/Package: 0603; Case Code (Metric): 1608; Case Code (Imperial): 0603; Min Operating Temperature: -55°C; Max Operating Temperature: 125°C; Packaging: Tape and Reel; Capacitance: 330pF; Tolerance: 5%; Dielectric: C0G; Voltage Rating: 50V; Voltage Rating (DC): 50V; Length: 1.6mm; Depth: 0.8mm; Radiation Hardening: No; REACH SVHC: Unknown; Supplier Part Number 1: 2496902
CON19 = Micro USB CHINA 1
D5 = D_ESD - USBLC6-2SC6: ESD Protection Device, 17 V, SOT-23, 6 Pins, 6 V, 85 W, USBLC Series; ComponentLink1Description: Datasheet; ComponentLink1URL: http://www.farnell.com/datasheets/1738051.pdf?_ga=2.108457538.1984085946.1565589483-1741076818.1563951383; Supplier 1: Farnell; Supplier Part Number 1: 1269406
L1 = L - BLM18KG101TN1D: Ferrite Bead, 0603 [1608 Metric], 100 ohm, 3 A, BLM18K Series, 0.03 ohm, ± 25%; ComponentLink1Description: Datasheet; ComponentLink1URL: https://www.murata.com/en-global/api/pdfdownloadapi?cate=luNoiseSupprFilteChipFerriBead&partno=BLM18KG101TN1%23; Supplier 1: Farnell; Supplier Part Number 1: 2443239
R36 = R - 1M: MULTICOMP - MC0063W060311M - RES, THICK FILM, 1M, 1%, 0.063W, 0603; IRNAS Part No.: I-100006; Resistance: 1; Voltage Rating: 50; Resistor Case Style: 0603 [1608 Metric]; Power Rating: 63; Product Range: MC Series; Temperature Coefficient: ± 100; SVHC: No SVHC (17-Dec-2015); External Depth: 0.45; External Length / Height: 1.6; External Width: 0.8; No. of Pins: 2; Reel Quantity: 5000; Resistor Mounting: Surface Mount Device; Temperature Coeff. +: 100; Voltage Rating V DC: 50V<!--FANDB--><div class="features-and-benefits-container"><div class="features-and-benefits-description"><span class="features-benefits-value">The Multicomp MC series current sense resistors are thick film chip resistors. The resistance range includes E96 and E24 decade values from 1ohm to 10Mohm.</span></div><div class="features-and-benefits-list"><ul class="features-and-benefits-list-list"><li class="features-and-benefits-list-item">EIA 0402, 0603, 0805, 1206 chip sizes available</li><li class="features-and-benefits-list-item">Small size and low weight</li><li class="features-and-benefits-list-item">Suitable for both wave and reflow soldering</li><li class="features-and-benefits-list-item">Reduction of assembly costs</li><li class="features-and-benefits-list-item">Maximum working voltage of 50V(0402, 0603), 150V(0805), 200V(1206)</li><li class="features-and-benefits-list-item">Available in ±1%, ±2% and ±5% tolerance</li><li class="features-and-benefits-list-item">Power rating of 62.5mW, 100mW and 125mW</li><li class="features-and-benefits-list-item">±400ppm/°C(1ohm to 10ohm), ±200ppm/°C(11ohm to 100ohm), ±100; Supplier 1: Farnell; Manufacturer: MULTICOMP; Manufacturer Part Number: MC0063W060311M; RoHS: Y-EX; Stock 1: 333415; Pricing 1: 10=0.0011, 100=0.001, 500=0.0009, 1000=0.0008, 2500=0.0007 (GBP); Resistance Tolerance: ± 1%; Packaging: Cut Tape; Resistor Element Material: Thick Film; Automotive Qualification Standard: -; Operating Temperature Max: 155; Operating Temperature Min: -55; Operating Temperature Range: -55°C to +155; Tape Width: 8; Temperature Coeff. -: 100; Tolerance +: 1%; Tolerance -: 1%; ComponentLink1URL: http://www.farnell.com/datasheets/1788326.pdf; ComponentLink1Description: http://www.farnell.com/datasheets/1788326.pdf; ComponentLink2URL: http://www.farnell.com/cad/1558928.zip; ComponentLink2Description: http://www.farnell.com/cad/1558928.zip; Supplier Part Number 1: 9330410
R42 R44 = R - 10R/0402: SMD Chip Resistor, 0402 [1005 Metric], 10 ohm, CRCW e3 Series, 50 V, Thick Film, 63 mW; Manufacturer: VISHAY; Manufacturer Part Number: RCA060310R0FKEA; IRNAS Part No.: I-100010; Resistance: 10; Voltage Rating: 75; Resistor Case Style: 0603 [1608 Metric]; Power Rating: 100; Resistance Tolerance: ± 1%; Product Range: RCA Series; Temperature Coefficient: ± 100; Automotive Qualification Standard: AEC-Q200; SVHC: No SVHC (17-Dec-2015)<!--FANDB--><div class="features-and-benefits-container"><div class="features-and-benefits-description"><span class="features-benefits-value">The RCA series from Vishay are automotive grade, sulphur resistant thick film rectangular chip resistors. The resistance range includes E24 and E96 decade values from 1ohm to 10Mohm. They provide superior resistance against H2S atmosphere. These resistors have metal glaze on high quality ceramic.</span></div><div class="features-and-benefits-list"><ul class="features-and-benefits-list-list"><li class="features-and-benefits-list-item">Automotive grade AEC-Q200 qualified (rev C)</li><li class="features-and-benefits-list-item">EIA 0402, 0603, 0805, 1206, 1210, 1218, 2010 and 2512 case sizes available</li><li class="features-and-benefits-list-item">Available in ±0.5%, ±1% and ±5% tolerances</li><li class="features-and-benefits-list-item">Jumpers are also available</li><li class="features-and-benefits-list-item">±50ppm/K, ±100ppm/K and ±200ppm/K TCR values</li><li class="features-and-benefits-list-item">Power rating of 0.063W, 0.10W, 0.125W, 0.25W, 0.5W, 0.75W and 1W at 70?C</li><li class="features-and-benefits-list-item">Available in 50V, 75V, 150V, 200V, 400V and 500V limiting voltage options</li><li class="features-and-benefits-list-item">Category temperature range from -55?C to 155?C</li><li class="features-and-benefits-list-item">Stability ?R/R = 1 % for 1000h at 70; RoHS: YES; Stock 1: 9559; Pricing 1: 10=0.0803, 100=0.0386, 500=0.0235, 2500=0.015, 5000=0.0135, 10000=0.0108, 50000=0.0068, 100000=0.0067 (GBP); Packaging: Cut Tape; Resistor Element Material: Thick Film; ComponentLink1URL: http://www.farnell.com/datasheets/2111201.pdf; ComponentLink1Description: http://www.farnell.com/datasheets/2111201.pdf; Supplier 1: Farnell; Supplier Part Number 1: 1652742

## Nets that join several sheets
5V: nRF_DK (P1.5), POWER_CONTROL (C49.2 U19.3), FTDI (C36.1 U14.1 U14.3), USB (C118.2 L1.2)
GND: MAIN (24 pins), nRF_DK (5 pins), ADC (13 pins), AN_MUX (6 pins), GPIO_EXTENDER (U13.25 U13.26 U13.33), POWER_CONTROL (46 pins), FTDI (55 pins), IDC (28 pins), USB (7 pins)
VBAT_1: POWER_CONTROL (C1.2 C3.2 U1.1 U2.1), IDC (P14.1)
VBAT_2: POWER_CONTROL (C5.2 C7.2 U3.1 U4.1), IDC (P15.1)
VBAT_3: POWER_CONTROL (C9.2 C11.2 U5.1 U6.1), IDC (P16.1)
VBAT_4: POWER_CONTROL (C13.2 C15.2 U7.1 U8.1), IDC (P17.1)
VDD: MAIN (6 pins), nRF_DK (P1.1 P1.2 P1.4 P20.2), ADC (13 pins), AN_MUX (R65.2 R67.2 R79.2 U18.26), GPIO_EXTENDER (R41.2 U13.27 U13.31), FTDI (24 pins), IDC (8 pins)
ACT_LED_1_GREEN: GPIO_EXTENDER (U13.10), IDC (D1.4 P9.18)
ACT_LED_1_RED: GPIO_EXTENDER (U13.9), IDC (D1.2 P9.16)
ACT_LED_2_GREEN: GPIO_EXTENDER (U13.12), IDC (D2.4 P11.18)
ACT_LED_2_RED: GPIO_EXTENDER (U13.11), IDC (D2.2 P11.16)
ACT_LED_3_GREEN: GPIO_EXTENDER (U13.14), IDC (D3.4 P12.18)
ACT_LED_3_RED: GPIO_EXTENDER (U13.13), IDC (D3.2 P12.16)
ACT_LED_4_GREEN: GPIO_EXTENDER (U13.16), IDC (D4.4 P13.18)
ACT_LED_4_RED: GPIO_EXTENDER (U13.15), IDC (D4.2 P13.16)
DIO0: GPIO_EXTENDER (U13.1), POWER_CONTROL (R23.2)
DIO1: GPIO_EXTENDER (U13.2), POWER_CONTROL (R25.2)
DIO2: GPIO_EXTENDER (U13.3), POWER_CONTROL (R27.2)
DIO3: GPIO_EXTENDER (U13.4), POWER_CONTROL (R29.2)
DIO4: GPIO_EXTENDER (U13.5), POWER_CONTROL (R31.2)
DIO5: GPIO_EXTENDER (U13.6), POWER_CONTROL (R33.2)
DIO6: GPIO_EXTENDER (U13.7), POWER_CONTROL (R35.2)
DIO7: GPIO_EXTENDER (U13.8), POWER_CONTROL (R38.2)
DIO16: GPIO_EXTENDER (U13.17), IDC (P13.17 R77.1)
DIO17: GPIO_EXTENDER (U13.18), IDC (P13.15 R78.1)
DIO18: GPIO_EXTENDER (U13.19), IDC (P12.17 R75.1)
DIO19: GPIO_EXTENDER (U13.20), IDC (P12.15 R76.1)
DIO20: GPIO_EXTENDER (U13.21), IDC (P11.17 R73.1)
DIO21: GPIO_EXTENDER (U13.22), IDC (P11.15 R74.1)
DIO22: GPIO_EXTENDER (U13.23), IDC (P9.17 R71.1)
DIO23: GPIO_EXTENDER (U13.24), IDC (P9.15 R72.1)
IDC1_2_nRF52_SWDCLK: AN_MUX (U18.2), IDC (P9.2 P22.4)
IDC1_3_nRF52_SWDIO: AN_MUX (U18.3), IDC (P9.3 P22.2)
IDC1_4_nRF52_RESET: MAIN (T1.6), IDC (P9.4 P22.10)
IDC1_5_TEST_1: ADC (U9.4), IDC (P9.5)
IDC1_6_TEST_2: ADC (U9.5), IDC (P9.6)
IDC1_7_TEST_3: ADC (U9.6), IDC (P9.7)
IDC1_8_TEST_4: ADC (U9.7), IDC (J1.1 P9.8)
IDC1_9_UART_TX: MAIN (NT1.2), IDC (P9.9)
IDC1_10_UART_RX: MAIN (NT2.2), IDC (P9.10)
IDC1_11_nRF91_RESET: MAIN (T1.3), IDC (P9.11)
IDC1_12_nRF91_SWDIO: AN_MUX (U18.5), IDC (P9.12)
IDC1_13_nRF91_SWDCLK: AN_MUX (U18.4), IDC (P9.13)
IDC1_nRF52_RESET: MAIN (R5.1), nRF_DK (P3.4)
IDC1_nRF91_RESET: MAIN (R6.1), nRF_DK (P3.5)
IDC2_2_nRF52_SWDCLK: AN_MUX (U18.6), IDC (P11.2 P21.4)
IDC2_3_nRF52_SWDIO: AN_MUX (U18.7), IDC (P11.3 P21.2)
IDC2_4_nRF52_RESET: MAIN (T2.6), IDC (P11.4 P21.10)
IDC2_5_TEST_1: ADC (U10.4), IDC (P11.5)
IDC2_6_TEST_2: ADC (U10.5), IDC (P11.6)
IDC2_7_TEST_3: ADC (U10.6), IDC (P11.7)
IDC2_8_TEST_4: ADC (U10.7), IDC (J2.1 P11.8)
IDC2_9_UART_TX: MAIN (NT3.2), IDC (P11.9)
IDC2_10_UART_RX: MAIN (NT4.2), IDC (P11.10)
IDC2_11_nRF91_RESET: MAIN (T2.3), IDC (P11.11)
IDC2_12_nRF91_SWDIO: AN_MUX (U18.9), IDC (P11.12)
IDC2_13_nRF91_SWDCLK: AN_MUX (U18.8), IDC (P11.13)
IDC2_nRF52_RESET: MAIN (R9.1), nRF_DK (P3.6)
IDC2_nRF91_RESET: MAIN (R10.1), nRF_DK (P3.7)
IDC3_2_nRF52_SWDCLK: AN_MUX (U18.21), IDC (P12.2 P19.4)
IDC3_3_nRF52_SWDIO: AN_MUX (U18.20), IDC (P12.3 P19.2)
IDC3_4_nRF52_RESET: MAIN (T3.6), IDC (P12.4 P19.10)
IDC3_5_TEST_1: ADC (U11.4), IDC (P12.5)
IDC3_6_TEST_2: ADC (U11.5), IDC (P12.6)
IDC3_7_TEST_3: ADC (U11.6), IDC (P12.7)
IDC3_8_TEST_4: ADC (U11.7), IDC (J3.1 P12.8)
IDC3_9_UART_TX: MAIN (NT5.2), IDC (P12.9)
IDC3_10_UART_RX: MAIN (NT6.2), IDC (P12.10)
IDC3_11_nRF91_RESET: MAIN (T3.3), IDC (P12.11)
IDC3_12_nRF91_SWDIO: AN_MUX (U18.18), IDC (P12.12)
IDC3_13_nRF91_SWDCLK: AN_MUX (U18.19), IDC (P12.13)
IDC3_nRF52_RESET: MAIN (R13.1), nRF_DK (P3.8)
IDC3_nRF91_RESET: MAIN (R14.1), nRF_DK (P10.1)
IDC4_2_nRF52_SWDCLK: AN_MUX (U18.17), IDC (P13.2 P18.4)
IDC4_3_nRF52_SWDIO: AN_MUX (U18.16), IDC (P13.3 P18.2)
IDC4_4_nRF52_RESET: MAIN (T4.6), IDC (P13.4 P18.10)
IDC4_5_TEST_1: ADC (U12.4), IDC (P13.5)
IDC4_6_TEST_2: ADC (U12.5), IDC (P13.6)
IDC4_7_TEST_3: ADC (U12.6), IDC (P13.7)
IDC4_8_TEST_4: ADC (U12.7), IDC (J4.1 P13.8)
IDC4_9_UART_TX: MAIN (NT7.2), IDC (P13.9)
IDC4_10_UART_RX: MAIN (NT8.2), IDC (P13.10)
IDC4_11_nRF91_RESET: MAIN (T4.3), IDC (P13.11)
IDC4_12_nRF91_SWDIO: AN_MUX (U18.14), IDC (P13.12)
IDC4_13_nRF91_SWDCLK: AN_MUX (U18.15), IDC (P13.13)
IDC4_nRF52_RESET: MAIN (R17.1), nRF_DK (P10.2)
IDC4_nRF91_RESET: MAIN (R18.1), nRF_DK (P10.3)
P0.11: nRF_DK (P10.4 P10.6), FTDI (10 pins)
P0.16: MAIN (R1.1 SW1.3 SW1.4), nRF_DK (P2.3)
P0.17: MAIN (R2.1 SW2.3 SW2.4), nRF_DK (P2.4)
P0.18: MAIN (R3.1 SW3.3 SW3.4), nRF_DK (P2.5)
P0.19: MAIN (R4.1 SW4.3 SW4.4), nRF_DK (P2.6)
P0.30: MAIN (R62.1), nRF_DK (P10.9), ADC (5 pins), AN_MUX (U18.27), GPIO_EXTENDER (U13.30)
P0.31: MAIN (R63.1), nRF_DK (P10.10), ADC (5 pins), AN_MUX (U18.24), GPIO_EXTENDER (U13.29)
SWDCLK: nRF_DK (P4.4 R22.2), AN_MUX (U18.10)
SWDIO: nRF_DK (P4.2 R21.2), AN_MUX (U18.13)
UART1_RX: MAIN (NT1.1), FTDI (U20.5)
UART1_TX: MAIN (NT2.1), FTDI (U20.1)
UART2_RX: MAIN (NT3.1), FTDI (U21.5)
UART2_TX: MAIN (NT4.1), FTDI (U21.1)
UART3_RX: MAIN (NT5.1), FTDI (U22.5)
UART3_TX: MAIN (NT6.1), FTDI (U22.1)
UART4_RX: MAIN (NT7.1), FTDI (U23.5)
UART4_TX: MAIN (NT8.1), FTDI (U23.1)
USB_N: FTDI (U15.7), USB (R44.2)
USB_P: FTDI (U15.8), USB (R42.2)

## Assembly variants
BASIC: not fitted R65 R67